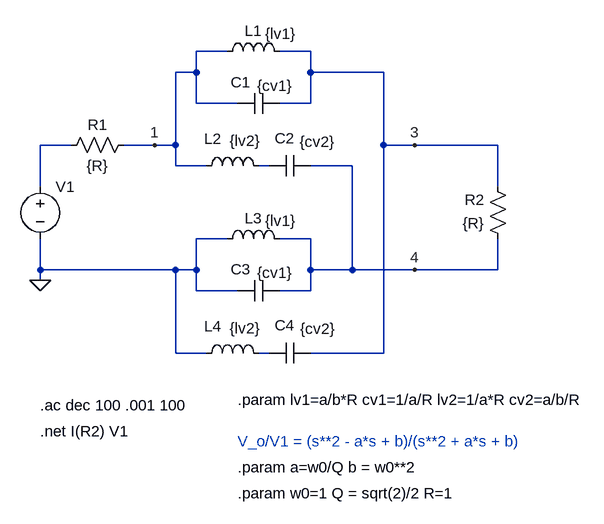
[diagram p0: schematic lattice_2ord_delay_eq.asc]
lattice_2ord_delay_eq.asc, the LTspice schematic file:
Version 4
SHEET 1 880 1328
WIRE 288 320 240 320
WIRE 416 320 368 320
WIRE 240 352 240 320
WIRE 240 352 208 352
WIRE 416 352 416 320
WIRE 528 352 416 352
WIRE 240 400 240 352
WIRE 304 400 240 400
WIRE 416 400 416 352
WIRE 416 400 368 400
WIRE 48 464 0 464
WIRE 176 464 128 464
WIRE 208 464 208 352
WIRE 208 464 176 464
WIRE 528 464 528 352
WIRE 576 464 528 464
WIRE 704 464 576 464
WIRE 208 496 208 464
WIRE 256 496 208 496
WIRE 352 496 336 496
WIRE 480 496 416 496
WIRE 0 528 0 464
WIRE 704 528 704 464
WIRE 288 608 240 608
WIRE 416 608 368 608
WIRE 0 656 0 608
WIRE 208 656 0 656
WIRE 240 656 240 608
WIRE 240 656 208 656
WIRE 416 656 416 608
WIRE 480 656 480 496
WIRE 480 656 416 656
WIRE 576 656 480 656
WIRE 704 656 704 608
WIRE 704 656 576 656
WIRE 0 672 0 656
WIRE 240 688 240 656
WIRE 304 688 240 688
WIRE 416 688 416 656
WIRE 416 688 368 688
WIRE 208 784 208 656
WIRE 256 784 208 784
WIRE 352 784 336 784
WIRE 528 784 528 464
WIRE 528 784 416 784
FLAG 0 672 0
FLAG 176 464 1
FLAG 576 464 3
FLAG 576 656 4
SYMBOL voltage 0 512 R0
WINDOW 3 24 96 Invisible 2
SYMATTR Value 0
SYMATTR InstName V1
SYMATTR Value2 AC 1 0
SYMATTR SpiceLine Rser=0
SYMBOL res 144 448 R90
WINDOW 0 0 56 VBottom 2
WINDOW 3 32 56 VTop 2
SYMATTR InstName R1
SYMATTR Value {R}
SYMBOL res 720 624 R180
WINDOW 0 36 76 Left 2
WINDOW 3 36 40 Left 2
SYMATTR InstName R2
SYMATTR Value {R}
SYMBOL ind 272 336 R270
WINDOW 0 32 56 VTop 2
WINDOW 3 59 98 VBottom 2
SYMATTR InstName L1
SYMATTR Value {lv1}
SYMATTR SpiceLine Rser=0
SYMBOL ind 240 512 R270
WINDOW 0 42 26 VTop 2
WINDOW 3 70 75 VBottom 2
SYMATTR InstName L2
SYMATTR Value {lv2}
SYMATTR SpiceLine Rser=0
SYMBOL cap 368 384 R90
WINDOW 0 -1 60 VBottom 2
WINDOW 3 -27 7 VTop 2
SYMATTR InstName C1
SYMATTR Value {cv1}
SYMBOL cap 416 480 R90
WINDOW 0 -11 40 VBottom 2
WINDOW 3 -37 -10 VTop 2
SYMATTR InstName C2
SYMATTR Value {cv2}
SYMBOL ind 272 624 R270
WINDOW 0 32 56 VTop 2
WINDOW 3 59 98 VBottom 2
SYMATTR InstName L3
SYMATTR Value {lv1}
SYMATTR SpiceLine Rser=0
SYMBOL ind 240 800 R270
WINDOW 0 42 26 VTop 2
WINDOW 3 70 75 VBottom 2
SYMATTR InstName L4
SYMATTR Value {lv2}
SYMATTR SpiceLine Rser=0
SYMBOL cap 368 672 R90
WINDOW 0 -1 60 VBottom 2
WINDOW 3 -27 7 VTop 2
SYMATTR InstName C3
SYMATTR Value {cv1}
SYMBOL cap 416 768 R90
WINDOW 0 -11 40 VBottom 2
WINDOW 3 -37 -11 VTop 2
SYMATTR InstName C4
SYMATTR Value {cv2}
TEXT 0 904 Left 2 !.net I(R2) V1
TEXT 0 864 Left 2 !.ac dec 100 .001 100
TEXT 304 920 Left 2 ;V_o/V1 = (s**2 - a*s + b)/(s**2 + a*s + b)
TEXT 304 960 Left 2 !.param a=w0/Q b = w0**2
TEXT 304 1000 Left 2 !.param w0=1 Q = sqrt(2)/2 R=1
TEXT 304 856 Left 2 !.param lv1=a/b*R cv1=1/a/R lv2=1/a*R cv2=a/b/R

The netlist it stands for:
* lattice_2ord_delay_eq.asc
V1 N001 0 0 AC 1 0 Rser=0
R1 1 N001 {R}
R2 4 3 {R}
L1 1 3 {lv1} Rser=0
L2 1 N002 {lv2} Rser=0
C1 3 1 {cv1}
C2 4 N002 {cv2}
L3 0 4 {lv1} Rser=0
L4 0 N003 {lv2} Rser=0
C3 4 0 {cv1}
C4 3 N003 {cv2}
.net I(R2) V1
.ac dec 100 .001 100
* V_o/V1 = (s**2 - a*s + b)/(s**2 + a*s + b)
.param a=w0/Q b = w0**2
.param w0=1 Q = sqrt(2)/2 R=1
.param lv1=a/b*R cv1=1/a/R lv2=1/a*R cv2=a/b/R
.backanno
.end